# EAGLE design SR latch (EAGLE 6.1)
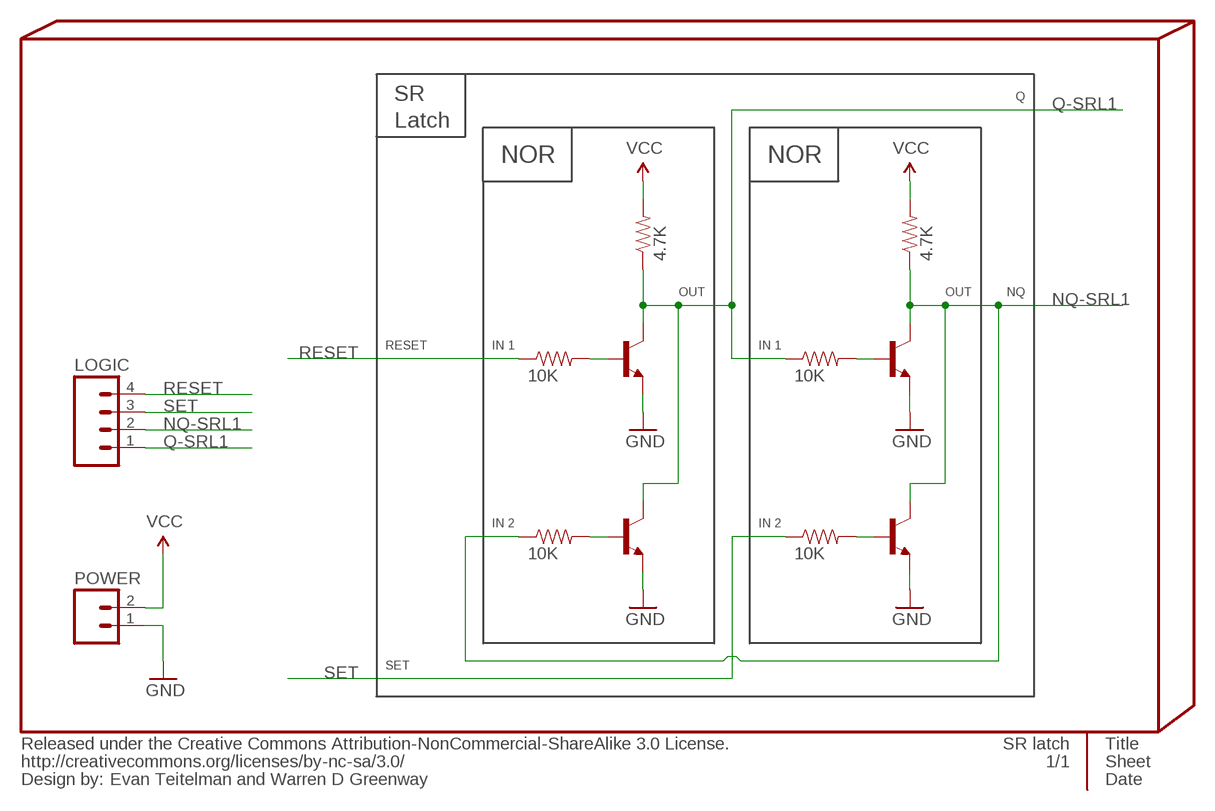
[diagram p0: schematic, sheet 1]

## Parts
INFO4  Evan Teitelman and Warren D Greenway  %CC-NC-SA  [%CC-NC-SA]
LOGIC  M04PTH  [1X04]
POWER  M02PTH  [1X02]
PUR-NOR1-SRL1  4.7K  RESISTOR0402-RES  [0402-RES]
PUR-NOR2-SRL1  4.7K  RESISTOR0402-RES  [0402-RES]
Q1-NOR1-SRL1  TRANSISTOR_NPNSOT23  [SOT23]
Q1-NOR2-SRL1  TRANSISTOR_NPNSOT23  [SOT23]
Q2-NOR1-SRL1  TRANSISTOR_NPNSOT23  [SOT23]
Q2-NOR2-SRL1  TRANSISTOR_NPNSOT23  [SOT23]
R1-NOR1-SRL1  10K  RESISTOR0402-RES  [0402-RES]
R1-NOR2-SRL1  10K  RESISTOR0402-RES  [0402-RES]
R2-NOR1-SRL1  10K  RESISTOR0402-RES  [0402-RES]
R2-NOR2-SRL1  10K  RESISTOR0402-RES  [0402-RES]

## Nets
GND: POWER.1 Q1-NOR1-SRL1.2(E) Q1-NOR2-SRL1.2(E) Q2-NOR1-SRL1.2(E) Q2-NOR2-SRL1.2(E) ; supply symbol labelled @GND
N$1: Q1-NOR2-SRL1.1(B) R1-NOR2-SRL1.2
N$2: Q2-NOR2-SRL1.1(B) R2-NOR2-SRL1.2
N$3: Q1-NOR1-SRL1.1(B) R1-NOR1-SRL1.2
N$4: Q2-NOR1-SRL1.1(B) R2-NOR1-SRL1.2
NQ-SRL1: LOGIC.2 PUR-NOR1-SRL1.1 Q1-NOR1-SRL1.3(C) Q2-NOR1-SRL1.3(C) R2-NOR2-SRL1.1
Q-SRL1: LOGIC.1 PUR-NOR2-SRL1.1 Q1-NOR2-SRL1.3(C) Q2-NOR2-SRL1.3(C) R1-NOR1-SRL1.1
RESET: LOGIC.4 R1-NOR2-SRL1.1
SET: LOGIC.3 R2-NOR1-SRL1.1
VCC: POWER.2 PUR-NOR1-SRL1.2 PUR-NOR2-SRL1.2 ; supply symbol labelled @VCC

## Notes on the sheet
- SR | Q
- Latch
- NOR | NOR
- OUT | OUT | NQ
- RESET | IN 1 | IN 1
- IN 2 | IN 2
- SET

## Library data of the parts
INFO4 = PygmyBoards:%CC-NC-SA: Released under the Creative Commons Attribution-NonCommercial-ShareAlike 3.0 License. http://creativecommons.org/licenses/by-sa/3.0 Design by: [Designer Name] Change this part's value to change the designer name
LOGIC = SparkFun:M04: Header 4 Standard 4-pin 0.1" header. Use with straight break away headers (SKU : PRT-00116), right angle break away headers (PRT-00553), swiss pins (PRT-00743), machine pins (PRT-00117), and female headers (PRT-00115). Molex polarized connector foot print use with SKU : PRT-08231 with associated crimp pins and housings. 1MM SMD Version SKU: PRT-10208
POWER = SparkFun:M02: Header 2 Standard 2-pin 0.1" header. Use with straight break away headers (SKU : PRT-00116), right angle break away headers (PRT-00553), swiss pins (PRT-00743), machine pins (PRT-00117), and female headers (PRT-00115). Molex polarized connector foot print use with SKU : PRT-08233 with associated crimp pins and housings.
PUR-NOR1-SRL1 PUR-NOR2-SRL1 R1-NOR1-SRL1 R1-NOR2-SRL1 R2-NOR1-SRL1 R2-NOR2-SRL1 = SparkFun:RESISTOR: Resistor Basic schematic elements and footprints for 0603, 1206, and PTH resistors.
Q1-NOR1-SRL1 Q1-NOR2-SRL1 Q2-NOR1-SRL1 Q2-NOR2-SRL1 = SparkFun:TRANSISTOR_NPN: Transistor NPN BJT configuration in SOT23 package. MMBT2222 is the common NPN we use. Double check BCE configuration again layout.

## Board
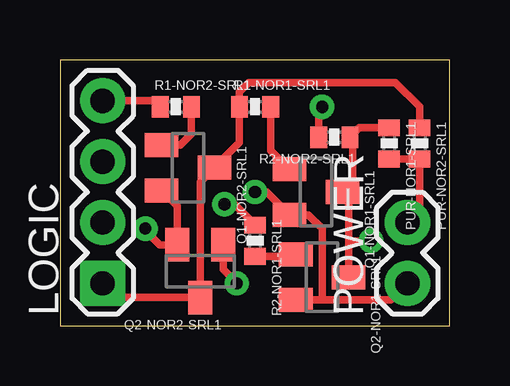
[diagram p1: board, top side]
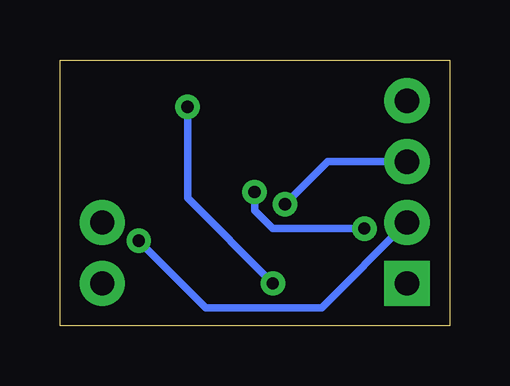
[diagram p2: board, bottom side, seen from below]

Size 16.24 x 11.1 mm. Coordinates in mm from the lower left corner, seen from the top.
Outline: 0,0 16.24,0 16.24,11.1 0,11.1 0,0
Copper layers (1*16): Top 0.035mm / dielectric 1.5mm / Bottom 0.035mm
Design rules: minimum track width 8mil, minimum drill 20mil, track to track 8mil, track to pad 8mil, pad to pad 4mil, via to via 8mil, smd to smd 4mil, copper to edge 15mil, drill to drill 8mil, minimum pad ring 12mil, minimum via ring 10mil, stop-mask expansion 4mil, vias tented up to drill 25mil, thermal gap 10mil

### Footprints (pad centres in the part's own frame; a part is rotated, then mirrored left to right if it is on the bottom)
1X04 = drill 1.016 pad 1.88 square: 1 0,0 | drill 1.016 pad 1.88: 2 2.54,0; 3 5.08,0; 4 7.62,0
1X02 = drill 1.016 pad 1.88: 1 0,0; 2 2.54,0
0402-RES = smd 0.7 x 0.9: 1 -0.65,0; 2 0.65,0
SOT23 = smd 1 x 1.4: 1 -0.95,-1.1; 2 0.95,-1.1; 3 0,1.1

### Placement (x,y rotation side)
INFO4  0,-7.62 0 top  (outside the outline)
LOGIC  1.78,1.78 90 top
POWER  14.48,1.78 90 top
PUR-NOR1-SRL1  13.72,7.62 270 top
PUR-NOR2-SRL1  14.99,7.62 270 top
Q1-NOR1-SRL1  10.67,5.59 270 top
Q1-NOR2-SRL1  5.33,6.6 270 top
Q2-NOR1-SRL1  10.92,2.03 270 top
Q2-NOR2-SRL1  5.84,2.29 180 top
R1-NOR1-SRL1  8.13,9.14 0 top
R1-NOR2-SRL1  4.83,9.14 0 top
R2-NOR1-SRL1  8.13,3.56 270 top
R2-NOR2-SRL1  11.43,7.87 180 top

### Tracks (layer width: path | path; a pad name or v marks a point on that pad's centre or on a via)
GND  (via drill 0.51)
  Top 0.305: 10.92,1.08 Q2-NOR1-SRL1.2 | 10.92,1.08 13.78,1.08 POWER.1 | 10.92,1.08 10.92,4.06 10.35,4.64 Q1-NOR1-SRL1.2 8.62,5.59 v8.13,5.59 | Q1-NOR2-SRL1.2 4.89,5 Q2-NOR2-SRL1.2 4.15,3.39 3.56,3.98 v3.56,4.06
  Bottom 0.305: v8.13,5.59 8.13,4.83 7.37,4.06 v3.56,4.06
N$1
  Top 0.305: R1-NOR2-SRL1.2 5.48,8.02 5.01,7.55 Q1-NOR2-SRL1.1
N$2  (via drill 0.51)
  Top 0.305: v10.92,9.14 10.78,9 R2-NOR2-SRL1.2 | Q2-NOR2-SRL1.1 6.79,2.35 v7.37,1.78
  Bottom 0.305: v7.37,1.78 10.92,5.33 v10.92,9.14
N$3
  Top 0.305: R1-NOR1-SRL1.2 8.78,7.33 Q1-NOR1-SRL1.1
N$4
  Top 0.305: R2-NOR1-SRL1.2 9.75,2.91 Q2-NOR1-SRL1.1
NQ-SRL1  (via drill 0.51)
  Top 0.305: 12.02,3.56 Q2-NOR1-SRL1.3 | 12.02,3.56 12.02,5.33 Q1-NOR1-SRL1.3 12.19,6.01 12.19,7.76 R2-NOR2-SRL1.1 12.48,8.27 PUR-NOR1-SRL1.1 | v12.95,3.56 12.02,3.56
  Bottom 0.305: v12.95,3.56 10.16,0.76 5.33,0.76 LOGIC.2
Q-SRL1
  Top 0.305: LOGIC.1 2.37,1.19 Q2-NOR2-SRL1.3 5.84,6.01 Q1-NOR2-SRL1.3 7.48,7.65 R1-NOR1-SRL1.1 7.48,9.76 7.87,10.16 13.97,10.16 14.99,9.14 PUR-NOR2-SRL1.1
RESET
  Top 0.305: R1-NOR2-SRL1.1 3.92,9.4 LOGIC.4
SET  (via drill 0.51)
  Top 0.305: R2-NOR1-SRL1.1 7.25,5.08 v6.86,5.08
  Bottom 0.305: v6.86,5.08 5.08,6.86 LOGIC.3
VCC
  Top 0.305: POWER.2 14.99,4.83 PUR-NOR2-SRL1.2 PUR-NOR1-SRL1.2